# EAGLE design CycloneSpindleCntl_v1.2_THT (EAGLE 6.3)
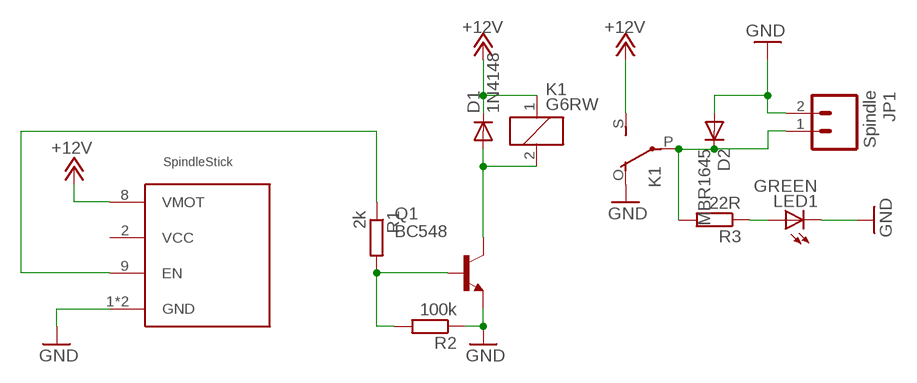
[diagram p0: schematic, sheet 1]

## Parts
D1  1N4148  [0207/2V]
D2  MBR1645  BYT08P  [TO220ACS]
JP1  Spindle  M025MM  [SCREWTERMINAL-5MM-2]
K1  G6RW  [G6RW]
LED1  GREEN  LED5MM  [LED5MM]
Q1  BC548  [TO92-EBC]
R1  2k  R-EU_0207/2V  [0207/2V]
R2  100k  R-EU_0207/2V  [0207/2V]
R3  22R  R-EU_0207/2V  [0207/2V]
U$1  SPINDLEDRIVERSTICK  [DIL16_MOD]

## Nets
+12V: D1.2(C) K1.1 K1.S(2:S) U$1.8(VMOT)
GND: D2.A JP1.2 K1.O(2:O) LED1.K(C) Q1.E R2.1 U$1.1(GND) U$1.7(GND)
N$1: LED1.A R3.1
N$2: Q1.B R1.2 R2.2
N$5: D1.1(A) K1.2 Q1.C
N$9: D2.C JP1.1 K1.P(2:P) R3.2
N$11: R1.1 U$1.9(EN)
Unconnected: U$1.2(VCC)

## Library data of the parts
D1 = diode:1N4148: DIODE high speed (Philips)
D2 = diode:BYT08P: DIODE ultra fast
JP1 = SparkFun-Connectors:M02: Standard 2-pin 0.1" header. Use with - straight break away headers ( PRT-00116) - right angle break away headers (PRT-00553) - swiss pins (PRT-00743) - machine pins (PRT-00117) - female headers (PRT-00115) Molex polarized connector foot print use with: PRT-08233 with associated crimp pins and housings. 2.54_SCREWTERM for use with PRT-10571. 3.5mm Screw Terminal footprints for PRT-08084 5mm Screw Terminal footprints for use with PRT-08433
K1 = relay:G6RW: RELAY 1 x switch, Omron; OC_FARNELL: unknown; OC_NEWARK: unknown
LED1 = led:LED: LED OSRAM: - CHIPLED LG R971, LG N971, LY N971, LG Q971, LY Q971, LO R971, LY R971 LH N974, LH R974 LS Q976, LO Q976, LY Q976 LO Q996 - Hyper CHIPLED LW Q18S LB Q993, LB Q99A, LB R99A - SideLED LS A670, LO A670, LY A670, LG A670, LP A670 LB A673, LV A673, LT A673, LW A673 LH A674 LY A675 LS A676, LA A676, LO A676, LY A676, LW A676 LS A679, LY A679, LG A679 - Hyper Micro SIDELED® LS Y876, LA Y876, LO Y876, LY Y876 LT Y87S - SmartLED LW L88C, LW L88S LB L89C, LB L89S, LG L890 LS L89K, LO L89K, LY L89K LS L896, LA L896, LO L896, LY L896 - TOPLED LS T670, LO T670, LY T670, LG T670, LP T670 LSG T670, LSP T670, LSY T670, LOP T670, LYG T670 LG T671, LOG T671, LSG T671 LB T673, LV T673, LT T673, LW T673 LH T674 LS T676, LA T676, LO T676, LY T676, LB T676, LH T676, LSB T676, LW T676 LB T67C, LV T67C, LT T67C, LS T67K, LO T67K, LY T67K, LW E67C LS E67B, LA E67B, LO E67B, LY E67B, LB E67C, LV E67C, LT E67C LW T67C LS T679, LY T679, LG T679 LS T770, LO T770, LY T770, LG T770, LP T770 LB T773, LV T773, LT T773, LW T773 LH T774 LS E675, LA E675, LY E675, LS T675 LS T776, LA T776, LO T776, LY T776, LB T776 LHGB T686 LT T68C, LB T68C - Hyper Mini TOPLED® LB M676 - Mini TOPLED Santana® LG M470 LS M47K, LO M47K, LY M47K Source: http://www.osram.convergy.de LUXEON: - LUMILED® LXK2-PW12-R00, LXK2-PW12-S00, LXK2-PW14-U00, LXK2-PW14-V00 LXK2-PM12-R00, LXK2-PM12-S00, LXK2-PM14-U00 LXK2-PE12-Q00, LXK2-PE12-R00, LXK2-PE12-S00, LXK2-PE14-T00, LXK2-PE14-U00 LXK2-PB12-K00, LXK2-PB12-L00, LXK2-PB12-M00, LXK2-PB14-N00, LXK2-PB14-P00, LXK2-PB14-Q00 LXK2-PR12-L00, LXK2-PR12-M00, LXK2-PR14-Q00, LXK2-PR14-R00 LXK2-PD12-Q00, LXK2-PD12-R00, LXK2-PD12-S00 LXK2-PH12-R00, LXK2-PH12-S00 LXK2-PL12-P00, LXK2-PL12-Q00, LXK2-PL12-R00 Source: www.luxeon.com KINGBRIGHT: KA-3528ASYC Source: www.kingbright.com
Q1 = transistor-npn:BC548*: NPN Transistor
R1-R3 = rcl:R-EU_: RESISTOR, European symbol
U$1 = reprap:SPINDLEDRIVERSTICK

## Board
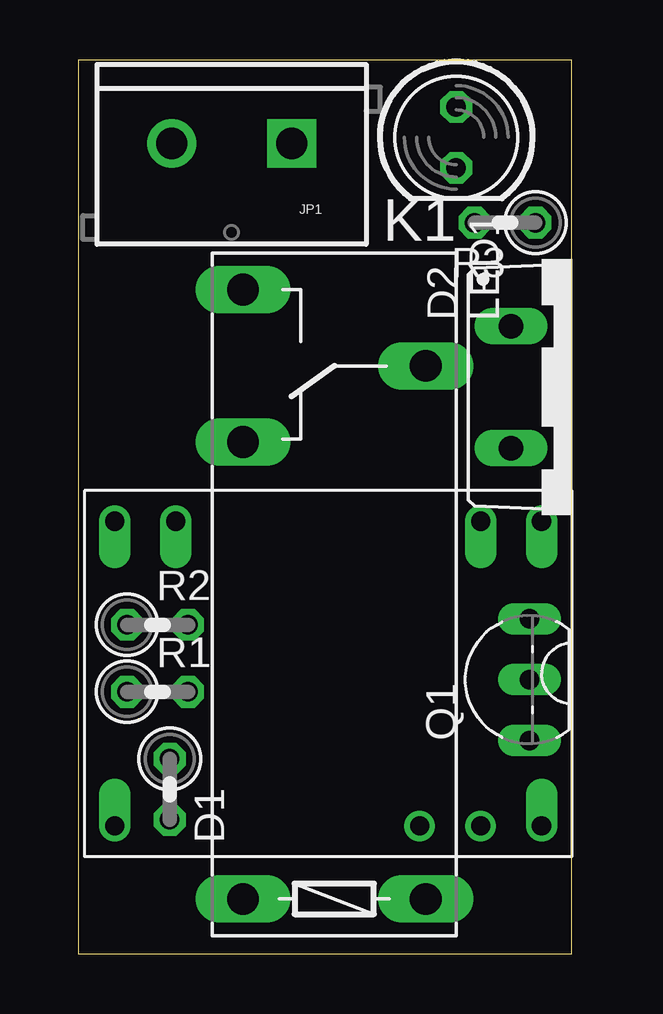
[diagram p1: board, top side]
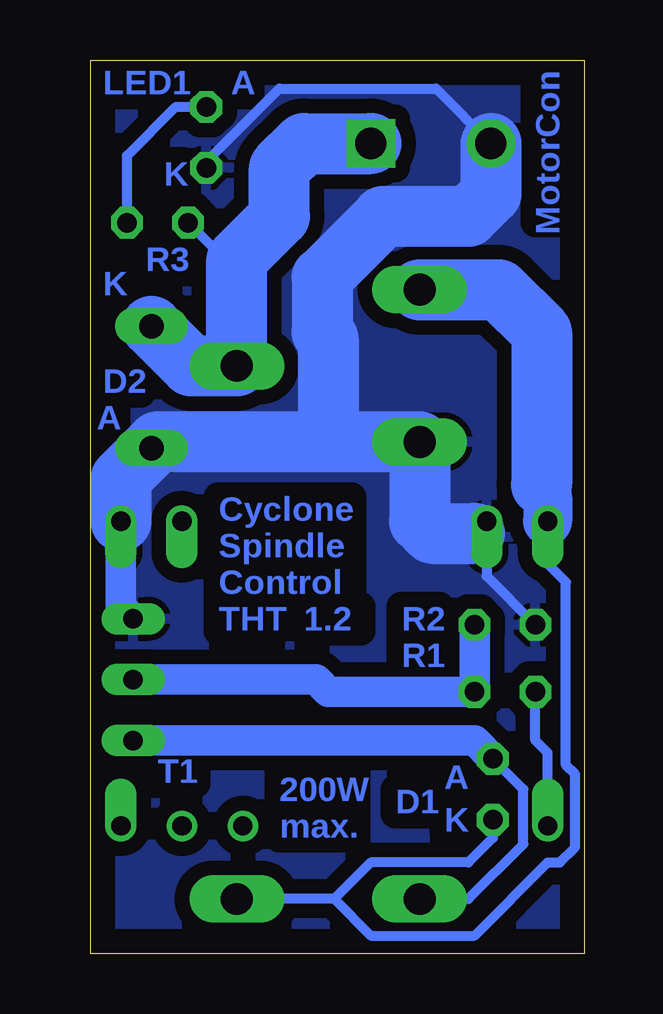
[diagram p2: board, bottom side, seen from below]

Size 20.55 x 37.26 mm. Coordinates in mm from the lower left corner, seen from the top.
Outline: 0,0 20.55,0 20.55,37.26 0,37.26 0,0
Copper layers (1*16): Top 0.035mm / dielectric 1.5mm / Bottom 0.035mm
Design rules "default": minimum track width 10mil, minimum drill 24mil, track to track 8mil, track to pad 8mil, pad to pad 8mil, via to via 8mil, smd to smd 8mil, copper to edge 40mil, drill to drill 8mil, minimum pad ring 10mil, minimum via ring 8mil, stop-mask expansion 4mil, vias tented up to drill 0mil, thermal gap 10mil

### Footprints (pad centres in the part's own frame; a part is rotated, then mirrored left to right if it is on the bottom)
0207/2V = drill 0.813 octagon: 1 -1.27,0; 2 1.27,0
TO220ACS = drill 1.016 long: A 2.54,-2.54; C -2.54,-2.54
SCREWTERMINAL-5MM-2 = drill 1.3 pad 2.032 square: 1 0,0 | drill 1.3 pad 2.032: 2 5,0
G6RW = drill 1.321 long: 1 -12.7,-3.81; 2 -12.7,3.81; O 6.35,3.81; P 9.525,-3.81; S 12.7,3.81
LED5MM = drill 0.813 octagon: A -1.27,0; K 1.27,0
TO92-EBC = drill 0.813 long: B 0,-1.27; C -2.54,-1.27; E 2.54,-1.27
DIL16_MOD = drill 0.8 offset: 1 0,0; 2 0,-2.54; 7 0,-15.24; 8 0,-17.78; 9 12.7,-17.78; 16 12.7,0

### Placement (x,y rotation side)
D1  3.81,6.86 270 top
D2  20.57,23.62 270 top
JP1  8.89,33.78 180 top
K1  10.67,14.99 90 top
LED1  15.75,34.04 270 top
Q1  17.53,11.43 90 top
R1  3.3,10.92 0 top
R2  3.3,13.72 0 top
R3  17.78,30.48 180 top
U$1  19.3,18.03 270 top

### Tracks (layer width: path | path; a pad name or v marks a point on that pad's centre or on a via)
+12V
  Bottom 0.406: D1.2 3.81,4.83 4.83,3.81 8.89,3.81 10.41,2.29 | 10.41,2.29 K1.1 | 10.41,2.29 8.89,0.76 4.57,0.76 1.52,3.81 1.02,3.81 0.38,4.45 0.38,7.49 0.76,7.87 0.76,15.49 1.52,16.26 U$1.8
  Bottom 2.032: 1.78,19.56 1.78,19.3 1.52,19.05 U$1.8
  Bottom 2.54: K1.S 3.56,27.69 1.78,25.91 1.78,19.56
GND
  Bottom 0.406: LED1.K 15.75,33.02 12.7,36.07 6.18,36.07 JP1.2 | U$1.7 4.06,15.75 R2.1
  Bottom 1.27: 4.57,17.53 U$1.7 | U$1.1 19.3,14.48 Q1.E
  Bottom 2.54: 10.67,21.34 K1.O 6.86,18.03 6.35,17.53 4.57,17.53 | 10.67,21.34 17.78,21.34 D2.A 19.3,19.81 U$1.1 | 10.67,21.34 10.67,25.65 10.92,25.91 10.92,28.19 8.38,30.73 4.83,30.73 3.89,31.67 JP1.2
  pour Bottom (isolate 0.61): 0,37.34 20.57,37.34 20.57,0 0,0
N$1
  Bottom 0.406: R3.1 19.05,33.27 17.02,35.31 LED1.A
N$2
  Bottom 1.27: Q1.B 11.18,11.43 10.67,10.92 R1.2 R2.2
N$3  (via drill 0.8 pad 1.27)
  other vias: 16.76,5.33
N$4  (via drill 0.8 pad 1.27)
  other vias: 14.22,5.33
N$5
  Bottom 0.406: K1.2 4.83,2.29 2.54,4.57 2.54,6.86 D1.1
  Bottom 1.27: Q1.C 4.57,8.89 D1.1
N$9
  Bottom 0.406: R3.2 14.73,28.7 14.48,28.7
  Bottom 2.54: D2.C 16.38,24.51 K1.P 14.48,28.7 14.48,28.96 12.7,30.73 12.7,32.77 11.68,33.78 JP1.1
N$11
  Bottom 0.406: U$1.9 1.52,8.38 2.03,8.89 R1.1

### Text on the board
Bottom: MotorCon | A | LED1 | K | R3 | K | D2 | A | Cyclone | Spindle | Control | R2 | 1.2 | THT | R1 | A | T1 | D1 | 200W | K | max.